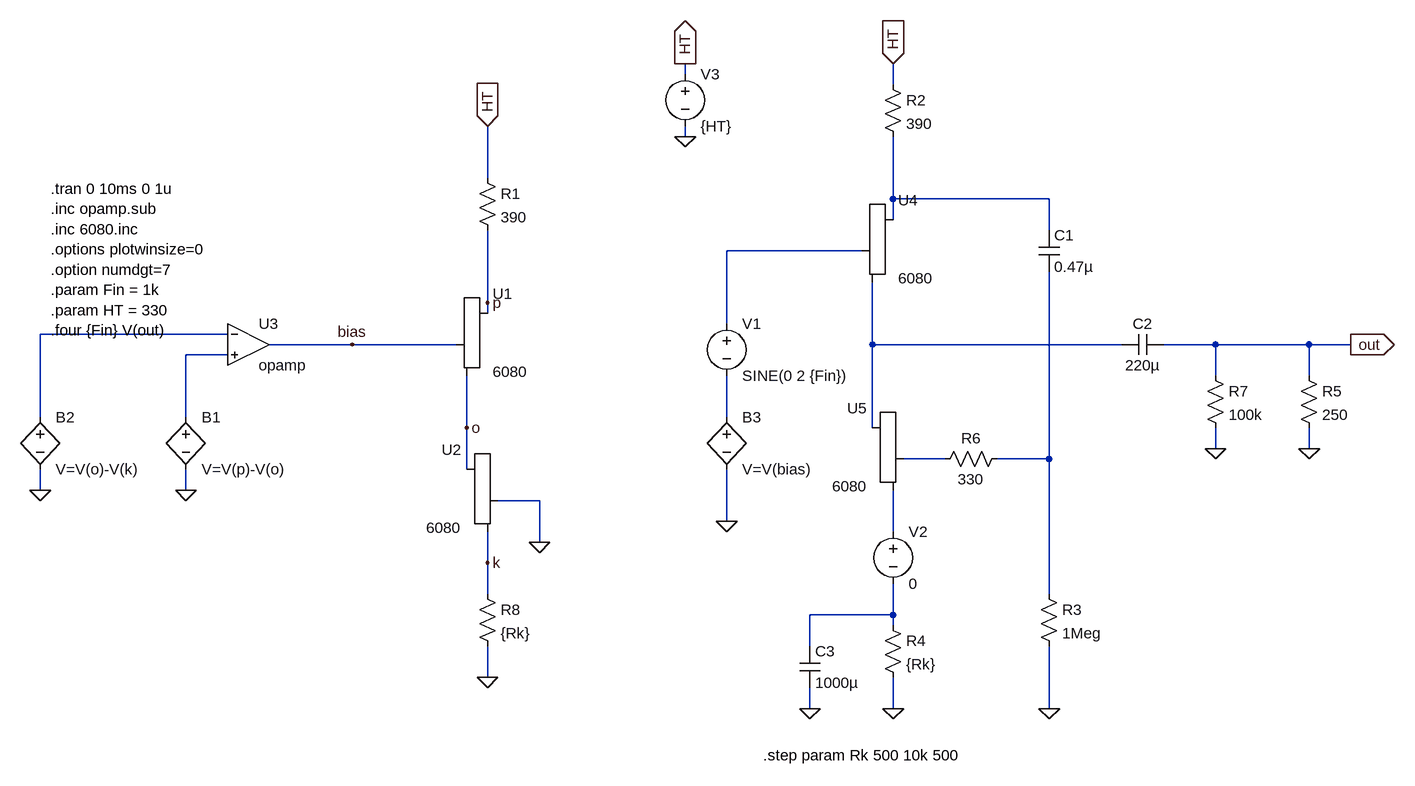
[diagram p0: schematic OTL 6SN7 biasing.asc]
OTL 6SN7 biasing.asc, the LTspice schematic file:
Version 4
SHEET 1 1956 792
WIRE 848 -272 848 -288
WIRE 1168 -256 1168 -288
WIRE 848 -176 848 -192
WIRE 544 -112 544 -192
WIRE 1168 -80 1168 -176
WIRE 1408 -80 1168 -80
WIRE 1168 -48 1168 -80
WIRE 1408 -32 1408 -80
WIRE 1120 0 912 0
WIRE 544 80 544 -32
WIRE 544 96 544 80
WIRE 912 112 912 0
WIRE 144 128 -144 128
WIRE 336 144 208 144
WIRE 496 144 336 144
WIRE 1136 144 1136 48
WIRE 1520 144 1136 144
WIRE 1664 144 1584 144
WIRE 1808 144 1664 144
WIRE 1872 144 1808 144
WIRE 144 160 80 160
WIRE 1664 192 1664 144
WIRE 1808 192 1808 144
WIRE -144 256 -144 128
WIRE 80 256 80 160
WIRE 912 256 912 192
WIRE 512 272 512 192
WIRE 1136 272 1136 144
WIRE 1664 304 1664 272
WIRE 1808 304 1808 272
WIRE 1248 320 1184 320
WIRE 1408 320 1408 32
WIRE 1408 320 1328 320
WIRE 512 336 512 272
WIRE -144 368 -144 336
WIRE 80 368 80 336
WIRE 624 384 560 384
WIRE 912 416 912 336
WIRE 1168 432 1168 368
WIRE 624 448 624 384
WIRE 544 480 544 432
WIRE 544 528 544 480
WIRE 1408 528 1408 320
WIRE 1168 560 1168 512
WIRE 1168 560 1040 560
WIRE 1168 576 1168 560
WIRE 1040 608 1040 560
WIRE 544 656 544 608
WIRE 1040 704 1040 672
WIRE 1168 704 1168 656
WIRE 1408 704 1408 608
FLAG 624 448 0
FLAG 544 656 0
FLAG 544 480 k
FLAG -144 368 0
FLAG 80 368 0
FLAG 544 80 p
FLAG 512 272 o
FLAG 1408 704 0
FLAG 1168 704 0
FLAG 1872 144 out
IOPIN 1872 144 Out
FLAG 1808 304 0
FLAG 1040 704 0
FLAG 1168 -288 HT
IOPIN 1168 -288 In
FLAG 1664 304 0
FLAG 336 144 bias
FLAG 544 -192 HT
IOPIN 544 -192 In
FLAG 912 416 0
FLAG 848 -176 0
FLAG 848 -288 HT
IOPIN 848 -288 Out
SYMBOL Misc/triode 544 144 R0
SYMATTR InstName U1
SYMATTR Value 6080
SYMBOL Misc/triode 512 384 M0
SYMATTR InstName U2
SYMATTR Value 6080
SYMBOL bv 80 240 R0
SYMATTR InstName B1
SYMATTR Value V=V(p)-V(o)
SYMBOL bv -144 240 R0
SYMATTR InstName B2
SYMATTR Value V=V(o)-V(k)
SYMBOL Opamps/opamp 176 80 R0
SYMATTR InstName U3
SYMBOL res 528 -128 R0
SYMATTR InstName R1
SYMATTR Value 390
SYMBOL Misc/triode 1168 0 R0
SYMATTR InstName U4
SYMATTR Value 6080
SYMBOL res 1152 -272 R0
SYMATTR InstName R2
SYMATTR Value 390
SYMBOL Misc/triode 1136 320 M0
SYMATTR InstName U5
SYMATTR Value 6080
SYMBOL res 1392 512 R0
SYMATTR InstName R3
SYMATTR Value 1Meg
SYMBOL cap 1392 -32 R0
SYMATTR InstName C1
SYMATTR Value 0.47µ
SYMBOL res 1152 560 R0
SYMATTR InstName R4
SYMATTR Value {Rk}
SYMBOL cap 1584 128 R90
WINDOW 0 0 32 VBottom 2
WINDOW 3 32 32 VTop 2
SYMATTR InstName C2
SYMATTR Value 220µ
SYMBOL res 1792 176 R0
SYMATTR InstName R5
SYMATTR Value 250
SYMBOL cap 1024 608 R0
SYMATTR InstName C3
SYMATTR Value 1000µ
SYMBOL voltage 1168 416 R0
SYMATTR InstName V2
SYMATTR Value 0
SYMBOL res 1344 304 R90
WINDOW 0 0 56 VBottom 2
WINDOW 3 32 56 VTop 2
SYMATTR InstName R6
SYMATTR Value 330
SYMBOL res 1648 176 R0
SYMATTR InstName R7
SYMATTR Value 100k
SYMBOL voltage 912 96 R0
SYMATTR InstName V1
SYMATTR Value SINE(0 2 {Fin})
SYMBOL bv 912 240 R0
SYMATTR InstName B3
SYMATTR Value V=V(bias)
SYMBOL res 528 512 R0
SYMATTR InstName R8
SYMATTR Value {Rk}
SYMBOL voltage 848 -288 R0
SYMATTR InstName V3
SYMATTR Value {HT}
TEXT -128 -96 Left 2 !.tran 0 10ms 0 1u\n.inc opamp.sub\n.inc 6080.inc\n.options plotwinsize=0\n.option numdgt=7\n.param Fin = 1k\n.param HT = 330\n.four {Fin} V(out)
TEXT 968 776 Left 2 !.step param Rk 500 10k 500

The netlist it stands for:
* OTL 6SN7 biasing.asc
XU1 p bias o 6080
XU2 o 0 k 6080
B1 N005 0 V=V(p)-V(o)
B2 N003 0 V=V(o)-V(k)
XU3 N003 N005 bias opamp Aol=100K GBW=10Meg  ; pins invin noninvin out
R1 HT p 390
XU4 N001 N002 N004 6080
R2 HT N001 390
XU5 N004 N007 N009 6080
R3 N008 0 1Meg
C1 N001 N008 0.47µ
R4 N010 0 {Rk}
C2 out N004 220µ
R5 out 0 250
C3 N010 0 1000µ
V2 N009 N010 0
R6 N008 N007 330
R7 out 0 100k
V1 N002 N006 SINE(0 2 {Fin})
B3 N006 0 V=V(bias)
R8 k 0 {Rk}
V3 HT 0 {HT}
.tran 0 10ms 0 1u
.inc opamp.sub
.inc 6080.inc
.options plotwinsize=0
.option numdgt=7
.param Fin = 1k
.param HT = 330
.four {Fin} V(out)
.step param Rk 500 10k 500
.backanno
.end